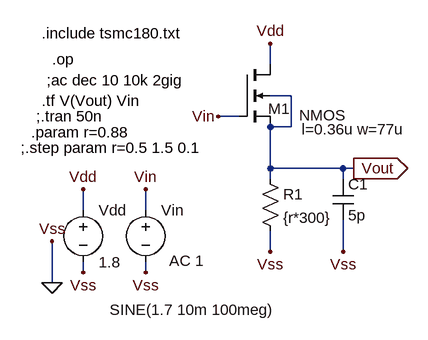
[diagram p0: schematic CD_amp_with_Rout_50.asc]
CD_amp_with_Rout_50.asc, the LTspice schematic file:
Version 4
SHEET 1 1164 680
WIRE 432 96 432 64
WIRE 464 144 432 144
WIRE 384 176 352 176
WIRE 464 192 464 144
WIRE 464 192 432 192
WIRE 432 256 432 192
WIRE 544 256 432 256
WIRE 560 256 544 256
WIRE 432 272 432 256
WIRE 544 272 544 256
WIRE 144 320 144 288
WIRE 240 320 240 288
WIRE 432 384 432 352
WIRE 544 384 544 336
WIRE 144 416 144 400
WIRE 240 416 240 400
WIRE 96 432 96 368
FLAG 96 432 0
FLAG 96 368 Vss
FLAG 240 288 Vin
FLAG 144 416 Vss
FLAG 240 416 Vss
FLAG 144 288 Vdd
FLAG 432 64 Vdd
FLAG 352 176 Vin
FLAG 432 384 Vss
FLAG 560 256 Vout
IOPIN 560 256 Out
FLAG 544 384 Vss
SYMBOL nmos4 384 96 R0
WINDOW 0 45 68 Left 2
WINDOW 3 92 78 Left 2
WINDOW 123 96 100 Left 2
SYMATTR InstName M1
SYMATTR Value2 l=0.36u w=77u
SYMBOL voltage 144 304 R0
WINDOW 123 0 0 Left 0
WINDOW 39 0 0 Left 0
SYMATTR InstName Vdd
SYMATTR Value 1.8
SYMBOL voltage 240 304 R0
WINDOW 3 -55 169 Left 2
WINDOW 123 36 94 Left 2
WINDOW 39 0 0 Left 0
SYMATTR Value SINE(1.7 10m 100meg)
SYMATTR Value2 AC 1
SYMATTR InstName Vin
SYMBOL cap 528 272 R0
SYMATTR InstName C1
SYMATTR Value 5p
SYMBOL res 416 256 R0
SYMATTR InstName R1
SYMATTR Value {r*300}
TEXT 80 48 Left 2 !.include tsmc180.txt
TEXT 96 88 Left 2 !.op
TEXT 88 120 Left 2 !;ac dec 10 10k 2gig
TEXT 80 152 Left 2 !.tf V(Vout) Vin
TEXT 72 176 Left 2 !;.tran 50n
TEXT 64 200 Left 2 !.param r=0.88
TEXT 48 224 Left 2 !;.step param r=0.5 1.5 0.1

The netlist it stands for:
* CD_amp_with_Rout_50.asc
M1 Vdd Vin Vout Vout NMOS l=0.36u w=77u
Vdd Vdd 0 1.8
Vin Vin 0 SINE(1.7 10m 100meg) AC 1
C1 Vout 0 5p
R1 Vout 0 {r*300}
.model NMOS NMOS
.model PMOS PMOS
.lib standard.mos
.include tsmc180.txt
.op
;ac dec 10 10k 2gig
.tf V(Vout) Vin
;.tran 50n
.param r=0.88
;.step param r=0.5 1.5 0.1
.backanno
.end